# EAGLE schematic Neg12Supply (EAGLE 8.3.2)
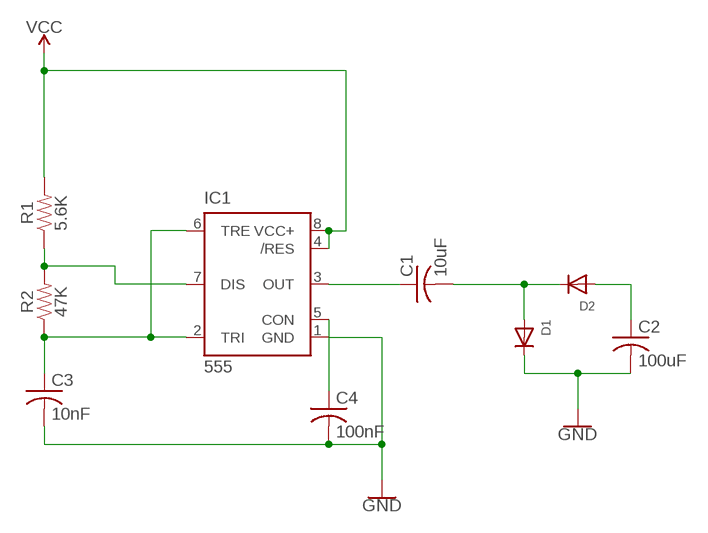
[diagram p0: schematic, sheet 1]

## Parts
C1  10uF  C-USC1206  [C1206]
C2  100uF  C-USC1206  [C1206]
C3  10nF  C-USC1206  [C1206]
C4  100nF  C-USC1206  [C1206]
D1  DIODESOD-123  [SOD-123]
D2  DIODESOD-123  [SOD-123]
IC1  555  555D  [SO08]
R1  5.6K  RESISTOR0805  [0805]
R2  47K  RESISTOR0805  [0805]

## Nets
GND: C2.2 C3.2 C4.2 D1.C IC1.1(GND)
N$3: C4.1 IC1.5(CON)
N$4: C1.1 IC1.3(OUT)
N$5: IC1.7(DIS) R1.1 R2.2
N$6: C3.1 IC1.2(TRI) IC1.6(TRE) R2.1
N$9: C1.2 D1.A D2.C
N$10: C2.1 D2.A
VCC: IC1.4(/RES) IC1.8(VCC+) R1.2

## Library data of the parts
C1-C4 = rcl:C-US: CAPACITOR, American symbol
D1 D2 = adafruit:DIODE: Diode SMADIODE - SMA Surface Mount Package 20V 1A Schottky Diode Digikey: 641-1014-6-ND DO-1N4148 - Through Hole Small Current Diode SOD-123 20V 1 A (.5mV Vf) Schottky Diode - Digikey: MBRX120TPMSCT-ND SOD-323 10V 570mA (.38mV Vf, 3ns) Schottky Diode - Digikey: ZLLS410CT-ND SOD-523 30V 30mA Schottky Diode (RB751S-40TE61) - Digikey: RB751S-40TE61CT-ND SOT23-R/W - SOT23 Package (R = Solder Paste/Reflow Ovens, W = Hand-Soldering) BAT54Film 40V 300mA - Digikey: 497-7162-1-ND
IC1 = SparkFun-IC-Special-Function:555: General purpose bipolar Timer Datasheet <http://www.sparkfun.com/datasheets/Components/General/ne555.pdf> SparkFun Products SparkFun SparkPunk Sequencer Kit <https://www.sparkfun.com/products/12707> (KIT-12707) Storefront Component: 555 Timer <https://www.sparkfun.com/products/9273> (COM-09273) Two parts valid for production: VFP: IC-11930 (M7555 PTH) VFP: IC-09173 (555 PTH) - Preferred; PROD_ID: NA-XXXXX
R1 R2 = SparkFun-Resistors:RESISTOR: Generic Resistor Package